# Altium schematic sheet МПСУ.464414.22-01 RF.SchDoc
size 420 x 297 mm; Address1: Address1; Address2: Address2; Address3: Address3; Address4: Address4; SheetNumber: 1; SheetTotal: 3; DocumentTypeSCH: Э3
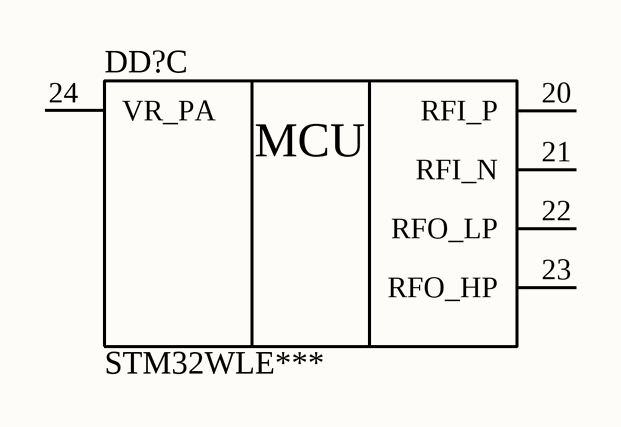
[diagram p0: МПСУ.464414.22-01 RF.SchDoc]

## Parts
DD?  DD?  [QFN50P700X700X90_HS-49N]  (value not drawn)  (part C of 5)

## Nets

Not connected (* = marked no-connect by the designer): DD? 20(RFI_P) 21(RFI_N) 22(RFO_LP) 23(RFO_HP) 24(VR_PA)

## Notes on the sheet
- Подп. и дата
- Инв. № дубл.
- Взам. инв. №
- Инв. № подл.
- Изм.
- Лист
- № докум.
- Подп.
- Дата
- Копировал
- Формат А3

## Library data of the parts
DD? = STM32WLE***: Multiprotocol LPWAN 32-bit Arm® Cortex®-M4 MCUs, LoRa®, (G)FSK, (G)MSK, BPSK, up to 256KB Flash, 64KB SRAM; Manufacturer: ST Electronics; Designer: Лазба; 3D_Body: +; ComponentLink1Description: Техническое описание; ComponentLink1URL: Q:\Libs\Descriptions_PDF\DS13105.pdf; Category: IC; Subcategory: MCU; Status: Check; PartNumber: STM32WLE***